# Altium schematic sheet Part15_I2C_LED.SchDoc
size A4
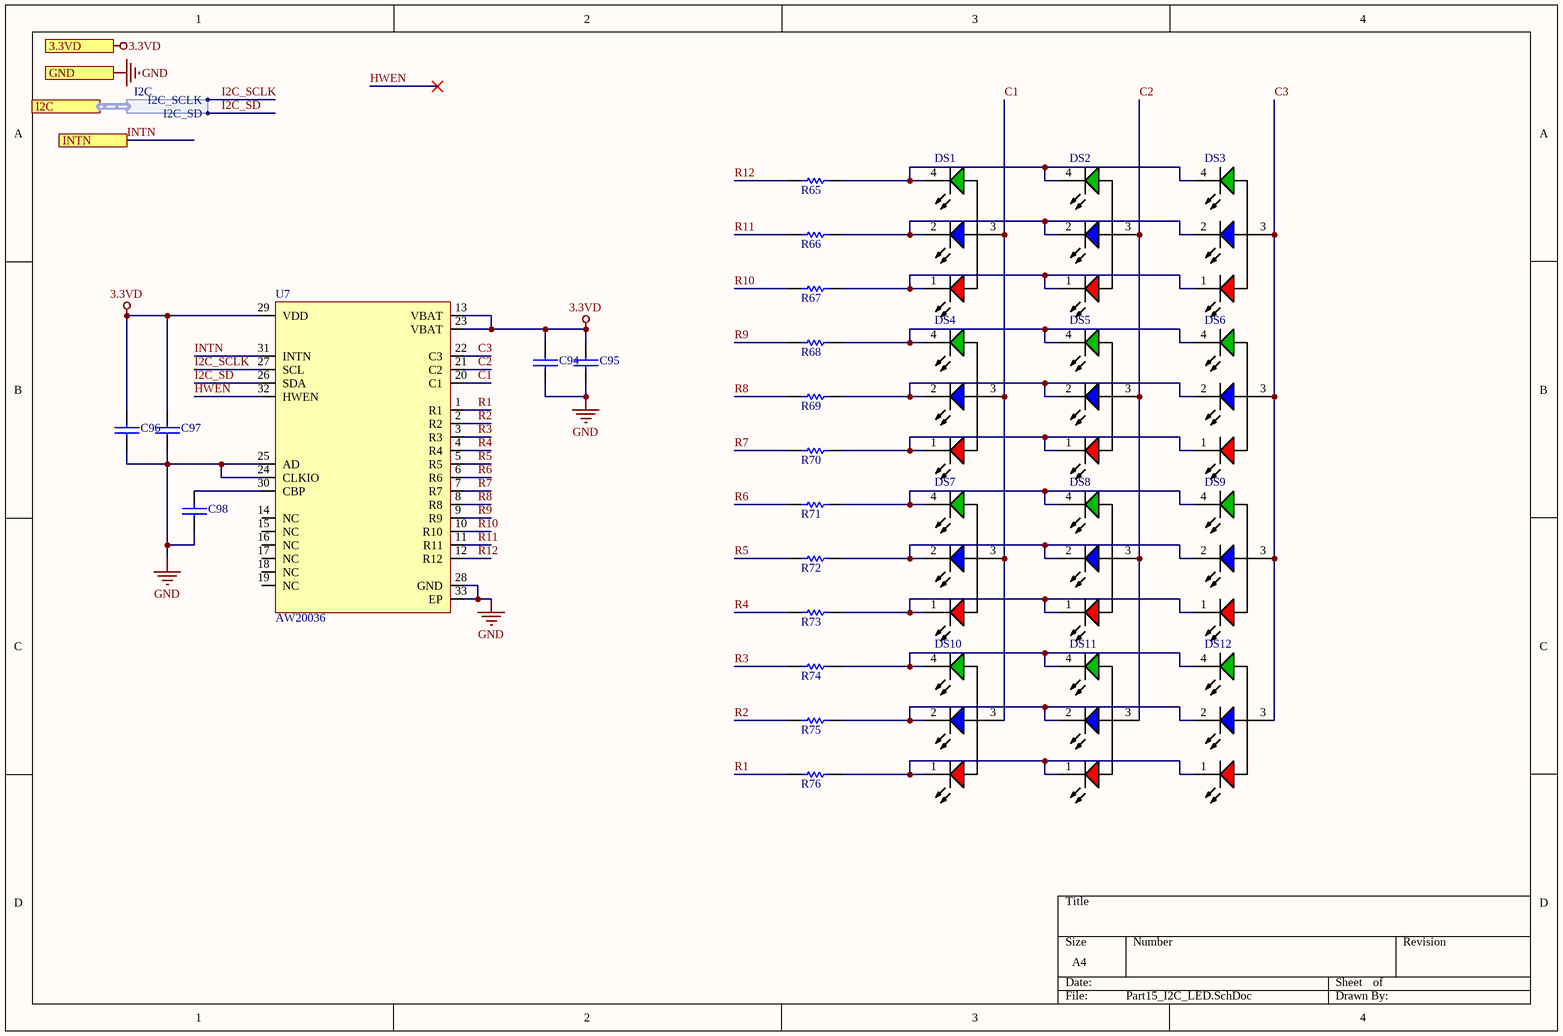
[diagram p0: Part15_I2C_LED.SchDoc]

## Parts
C94  100nF  [0402C]  (value not drawn)
C95  4.7uF  [0402C]  (value not drawn)
C96  1uF  [0402C]  (value not drawn)
C97  100nF  [0402C]  (value not drawn)
C98  1uF  [0402C]  (value not drawn)
DS1  CLVBA-FKA-CAEDH8BBB7A363  [RGB_LED]  (value not drawn)
DS2  CLVBA-FKA-CAEDH8BBB7A363  [RGB_LED]  (value not drawn)
DS3  CLVBA-FKA-CAEDH8BBB7A363  [RGB_LED]  (value not drawn)
DS4  CLVBA-FKA-CAEDH8BBB7A363  [RGB_LED]  (value not drawn)
DS5  CLVBA-FKA-CAEDH8BBB7A363  [RGB_LED]  (value not drawn)
DS6  CLVBA-FKA-CAEDH8BBB7A363  [RGB_LED]  (value not drawn)
DS7  CLVBA-FKA-CAEDH8BBB7A363  [RGB_LED]  (value not drawn)
DS8  CLVBA-FKA-CAEDH8BBB7A363  [RGB_LED]  (value not drawn)
DS9  CLVBA-FKA-CAEDH8BBB7A363  [RGB_LED]  (value not drawn)
DS10  CLVBA-FKA-CAEDH8BBB7A363  [RGB_LED]  (value not drawn)
DS11  CLVBA-FKA-CAEDH8BBB7A363  [RGB_LED]  (value not drawn)
DS12  CLVBA-FKA-CAEDH8BBB7A363  [RGB_LED]  (value not drawn)
R65  51R  [0402R]  (value not drawn)
R66  20R  [0402R]  (value not drawn)
R67  20R  [0402R]  (value not drawn)
R68  51R  [0402R]  (value not drawn)
R69  20R  [0402R]  (value not drawn)
R70  20R  [0402R]  (value not drawn)
R71  51R  [0402R]  (value not drawn)
R72  20R  [0402R]  (value not drawn)
R73  20R  [0402R]  (value not drawn)
R74  51R  [0402R]  (value not drawn)
R75  20R  [0402R]  (value not drawn)
R76  20R  [0402R]  (value not drawn)
U7  AW20036  [QFN40P400X400X80_HS-33N]

## Ports
3.3VD, GND, I2C (harness I2C), INTN

## Harnesses
I2C: I2C_SCLK, I2C_SD

## Nets
3.3VD: C94.1 C95.1 C96.1 C97.1 U7.13(VBAT) U7.23(VBAT) U7.29(VDD) ; port 3.3VD
GND: C94.2 C95.2 C96.2 C97.2 C98.2 U7.24(CLKIO) U7.25(AD) U7.28(GND) U7.33(EP) ; port GND
C1: DS1.3(COMMON) DS4.3(COMMON) DS7.3(COMMON) DS10.3(COMMON) U7.20(C1)
C2: DS2.3(COMMON) DS5.3(COMMON) DS8.3(COMMON) DS11.3(COMMON) U7.21(C2)
C3: DS3.3(COMMON) DS6.3(COMMON) DS9.3(COMMON) DS12.3(COMMON) U7.22(C3)
HWEN: U7.32(HWEN)
I2C_SCLK: U7.27(SCL) ; port I2C.I2C_SCLK
I2C_SD: U7.26(SDA) ; port I2C.I2C_SD
INTN: U7.31(INTN) ; port INTN
R1: R76.1 U7.1(R1)
R2: R75.1 U7.2(R2)
R3: R74.1 U7.3(R3)
R4: R73.1 U7.4(R4)
R5: R72.1 U7.5(R5)
R6: R71.1 U7.6(R6)
R7: R70.1 U7.7(R7)
R8: R69.1 U7.8(R8)
R9: R68.1 U7.9(R9)
R10: R67.1 U7.10(R10)
R11: R66.1 U7.11(R11)
R12: R65.1 U7.12(R12)
NetC98_1: C98.1 U7.30(CBP)
NetDS1_1: DS1.1(RED) DS2.1(RED) DS3.1(RED) R67.2
NetDS1_2: DS1.2(BLUE) DS2.2(BLUE) DS3.2(BLUE) R66.2
NetDS1_4: DS1.4(GREEN) DS2.4(GREEN) DS3.4(GREEN) R65.2
NetDS4_1: DS4.1(RED) DS5.1(RED) DS6.1(RED) R70.2
NetDS4_2: DS4.2(BLUE) DS5.2(BLUE) DS6.2(BLUE) R69.2
NetDS4_4: DS4.4(GREEN) DS5.4(GREEN) DS6.4(GREEN) R68.2
NetDS7_1: DS7.1(RED) DS8.1(RED) DS9.1(RED) R73.2
NetDS7_2: DS7.2(BLUE) DS8.2(BLUE) DS9.2(BLUE) R72.2
NetDS7_4: DS7.4(GREEN) DS8.4(GREEN) DS9.4(GREEN) R71.2
NetDS10_1: DS10.1(RED) DS11.1(RED) DS12.1(RED) R76.2
NetDS10_2: DS10.2(BLUE) DS11.2(BLUE) DS12.2(BLUE) R75.2
NetDS10_4: DS10.4(GREEN) DS11.4(GREEN) DS12.4(GREEN) R74.2

Not connected (* = marked no-connect by the designer): U7 14(NC) 15(NC) 16(NC) 17(NC) 18(NC) 19(NC)

## Library data of the parts
C94-C98 = CAP: 无极性电容
DS1-DS12 = LED-RGB-KCKK-4: 3-in-1 SMD Led, 1.9 V Red, 3 V Green, 3 V Blue, -40 to 100 degC, 4-Pin PLCC, RoHS, Reel; Luminous Intensity: 71mcd,140mcd,36mcd; Viewing Angle: 120deg; Brand: Cree,Inc.; Lens Color/Style: UVTinted; Forward Current: 20mA; LED Size: 3.2mmx2.8mmx1.9mm; Wavelength/Color Temperature: 630nm,527nm,470nm; Forward Voltage: 1.9V,3V,3V; Illumination Color: RGB; Package / Case: PLCC-4; Package Reference: PLCC-4; Packaging: Reel; Maximum Operating Temperature: +100C; Minimum Operating Temperature: -40C; Product Category: StandardLEDs-SMD; Manufacturer URL: http://www.cree.com/; RoHS: Details; Factory Pack Quantity: 2000; Datasheet URL: http://datasheet.octopart.com/CLVBA-FKA-CAEDH8BBB7A363-Cree-datasheet-44497822.pdf; Manufacturer: Cree,Inc.; Mounting Technology: SurfaceMount; Package Description: 4-Pin Plastic Leaded Chip Carrier, Body 3.2 x 2.8 mm; Datasheet Version: 12/2014
R65-R76 = RES